# Altium schematic sheet docking_station_with_STLink.SchDoc
size B; SheetNumber: 1; SheetTotal: 1
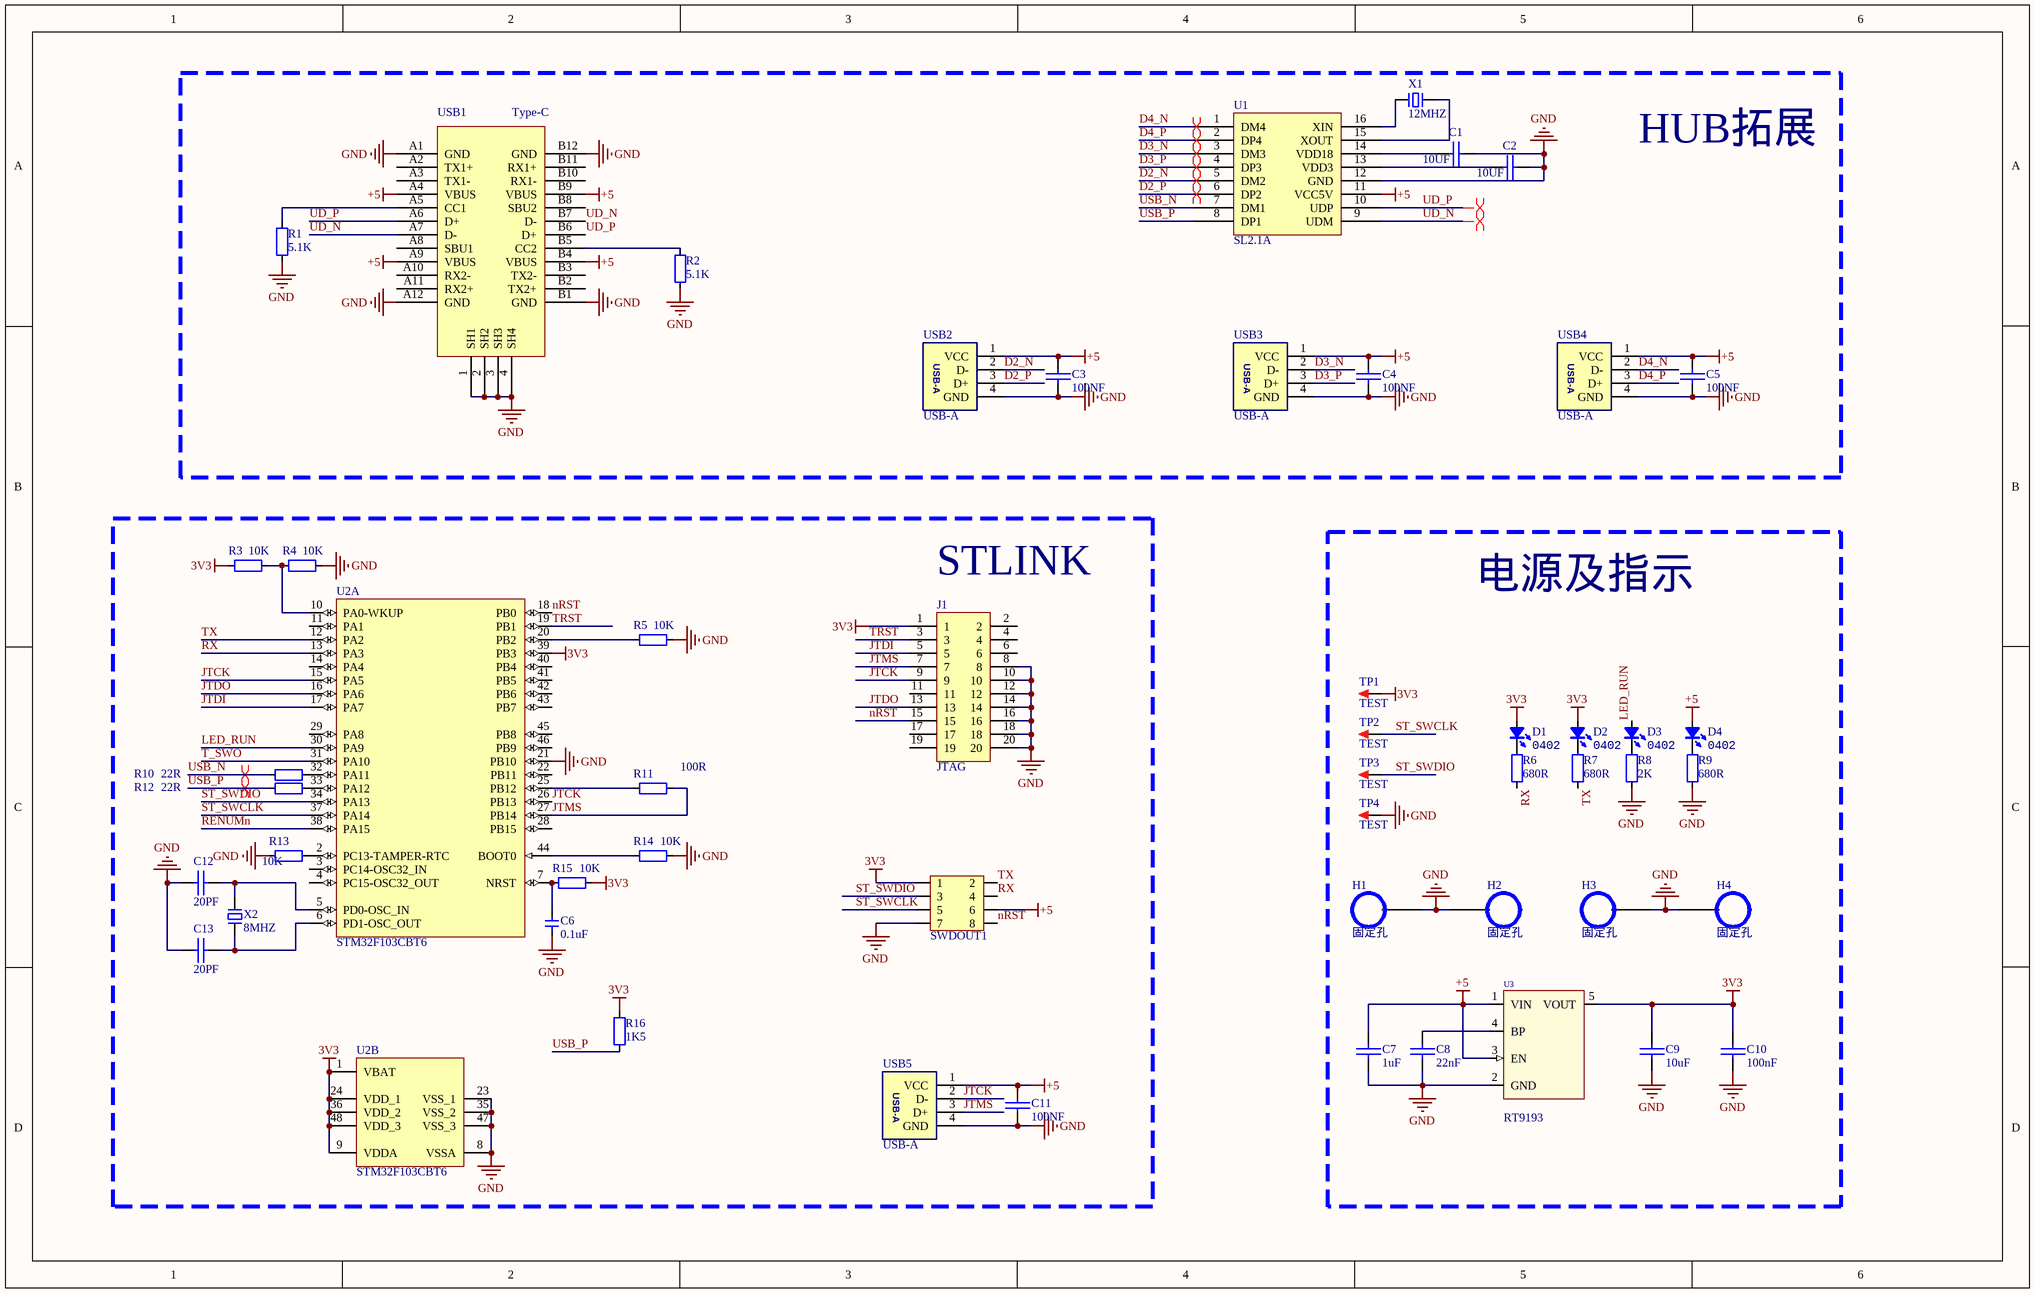
[diagram p0: docking_station_with_STLink.SchDoc]

## Parts
C1  10UF  [0603C]
C2  10UF  [0603C]
C3  100NF  [0603C]
C4  100NF  [0603C]
C5  100NF  [0603C]
C6  0.1uF  [0603C]
C7  1uF  [0603C]
C8  22nF  [0603C]
C9  10uF  [0603C]
C10  100nF  [0603C]
C11  100NF  [0603C]
C12  20PF  [0603C]
C13  20PF  [0603C]
D1  Type: 0402  [LED 0603B]  (hidden comment: color?)
D2  Type: 0402  [LED 0603B]  (hidden comment: color?)
D3  Type: 0402  [LED 0603B]  (hidden comment: color?)
D4  Type: 0402  [LED 0603B]  (hidden comment: color?)
H1  固定孔  [M3x4+6_N]
H2  固定孔  [M3x4+6_N]
H3  固定孔  [M3x4+6_N]
H4  固定孔  [M3x4+6_N]
J1  JTAG  [JLINK]
R1  5.1K  [0603R]
R2  5.1K  [0603R]
R3  10K  [0603R]
R4  10K  [0603R]
R5  10K  [0603R]
R6  680R  [0603R]
R7  680R  [0603R]
R8  2K  [0603R]
R9  680R  [0603R]
R10  22R  [0603R]
R11  100R  [0603R]
R12  22R  [0603R]
R13  10K  [0603R]
R14  10K  [0603R]
R15  10K  [0603R]
R16  1K5  [0603R]
SWDOUT1  HDR2x4_2.54  [Pin HDR2X4/2.54mm-S]  (value not drawn)
TP1  TEST  [TEST 1.6]
TP2  TEST  [TEST 1.6]
TP3  TEST  [TEST 1.6]
TP4  TEST  [TEST 1.6]
U1  SL2.1A  [SOP16]
U2  STM32F103CBT6  [LQFP48 7X7]  (parts A,B of 2)
U3  RT9193  [SOT23-5]
USB1  Type-C  [TYPE-C-SMD_TYPE-C-24P-QCHT]
USB2  USB-A  [USB-A/S_A]
USB3  USB-A  [USB-A/S_A]
USB4  USB-A  [USB-A/S_A]
USB5  USB-A  [USB-A/S_A]
X1  12MHZ  [OSC HC-49S]
X2  8MHZ  [OSC HC-49SMD]

## Blocks framed on the sheet
HUB拓展: C1-C5 R1 R2 U1 USB1-USB4 X1
STLINK: C6 C11-C13 J1 R3-R5 R10-R16 SWDOUT1 U2 USB5 X2
电源及指示: C7-C10 D1-D4 H1-H4 R6-R9 TP1-TP4 U3

## Nets
3V3: C9.2 C10.2 D1.1(A) D2.1(A) J1.1 R3.1 R15.2 R16.2 SWDOUT1.1 TP1.1 U2.1(VBAT) U2.9(VDDA) U2.24(VDD_1) U2.36(VDD_2) U2.39(PB3) U2.48(VDD_3) U3.5(VOUT)
+5: C3.2 C4.2 C5.2 C7.2 C11.2 D4.1(A) SWDOUT1.6 U1.11(VCC5V) U3.1(VIN) U3.3(EN) USB1.A4(VBUS) USB1.A9(VBUS) USB1.B4(VBUS) USB1.B9(VBUS) USB2.1(VCC) USB3.1(VCC) USB4.1(VCC) USB5.1(VCC)
GND: C1.2 C2.2 C3.1 C4.1 C5.1 C6.1 C7.1 C8.1 C9.1 C10.1 C11.1 C12.2 C13.2 H1.1 H2.1 H3.1 H4.1 J1.8 J1.10 J1.12 J1.14 J1.16 J1.18 J1.20 R1.2 R2.2 R4.2 R5.2 R8.1 R9.1 R13.1 R14.2 SWDOUT1.7 TP4.1 U1.12(GND) U2.8(VSSA) U2.21(PB10) U2.23(VSS_1) U2.35(VSS_2) U2.47(VSS_3) U3.2(GND) USB1.1(SH1) USB1.2(SH2) USB1.3(SH3) USB1.4(SH4) USB1.A1(GND) USB1.A12(GND) USB1.B1(GND) USB1.B12(GND) USB2.4(GND) USB3.4(GND) USB4.4(GND) USB5.4(GND)
D2_N: U1.5(DM2) USB2.2(D-)
D2_P: U1.6(DP2) USB2.3(D+)
D3_N: U1.3(DM3) USB3.2(D-)
D3_P: U1.4(DP3) USB3.3(D+)
D4_N: U1.1(DM4) USB4.2(D-)
D4_P: U1.2(DP4) USB4.3(D+)
JTCK: J1.9 U2.15(PA5) U2.26(PB13) USB5.2(D-)
JTDI: J1.5 U2.17(PA7)
JTDO: J1.13 U2.16(PA6)
JTMS: J1.7 R11.2 U2.27(PB14) USB5.3(D+)
LED_RUN: D3.1(A) U2.30(PA9)
nRST: J1.15 SWDOUT1.8 U2.18(PB0)
RENUMn: U2.38(PA15)
RX: R6.1 SWDOUT1.4 U2.13(PA3)
ST_SWCLK: SWDOUT1.5 TP2.1 U2.37(PA14)
ST_SWDIO: SWDOUT1.3 TP3.1 U2.34(PA13)
T_SWO: U2.31(PA10)
TRST: J1.3 U2.19(PB1)
TX: R7.1 SWDOUT1.2 U2.12(PA2)
UD_N: U1.9(UDM) USB1.A7(D-) USB1.B7(D-)
UD_P: U1.10(UDP) USB1.A6(D+) USB1.B6(D+)
USB_N: R10.1 U1.7(DM1)
USB_P: R12.1 R16.1 U1.8(DP1)
NetC1_1: C1.1 U1.14(VDD18)
NetC2_1: C2.1 U1.13(VDD3)
NetC6_2: C6.2 R15.1 U2.7(NRST)
NetC8_2: C8.2 U3.4(BP)
NetC12_1: C12.1 U2.5(PD0-OSC_IN) X2.1
NetC13_1: C13.1 U2.6(PD1-OSC_OUT) X2.2
NetD1_2: D1.2(K) R6.2
NetD2_2: D2.2(K) R7.2
NetD3_2: D3.2(K) R8.2
NetD4_2: D4.2(K) R9.2
NetR1_1: R1.1 USB1.A5(CC1)
NetR2_1: R2.1 USB1.B5(CC2)
NetR3_2: R3.2 R4.1 U2.10(PA0-WKUP)
NetR5_1: R5.1 U2.20(PB2)
NetR10_2: R10.2 U2.32(PA11)
NetR11_1: R11.1 U2.25(PB12)
NetR12_2: R12.2 U2.33(PA12)
NetR13_2: R13.2 U2.2(PC13-TAMPER-RTC)
NetR14_1: R14.1 U2.44(BOOT0)
NetU1_15: U1.15(XOUT) X1.1
NetU1_16: U1.16(XIN) X1.2

Not connected (* = marked no-connect by the designer): J1 2 4 6 11 17 19; U2 3(PC14-OSC32_IN) 4(PC15-OSC32_OUT) 11(PA1) 14(PA4) 22(PB11) 28(PB15) 29(PA8) 40(PB4) 41(PB5) 42(PB6) 43(PB7) 45(PB8) 46(PB9); USB1 A2(TX1+) A3(TX1-) A8(SBU1) A10(RX2-) A11(RX2+) B2(TX2+) B3(TX2-) B8(SBU2) B10(RX1-) B11(RX1+)

## Layout directives
differential pair: D2_N, D2_P, D3_N, D3_P, D4_N, D4_P, UD_N, UD_P, USB_N, USB_P

## Library data of the parts
C1-C5 C7-C13 = CAP: 无极性电容
C6 = 电容-0402: Capacitor; Value: 0.1u
D1-D4 = LED_0402: LED; Value: color?
J1 = Pin HDR2X10
R1-R9 R11 R13-R16 = 电阻-0402: Resistor; Value: 22R
R10 R12 = 电阻-0402: Resistor; Value: 22R
SWDOUT1 = HDR2x4_2.54: Header
TP1-TP4 = TEST: 测试点; 联系卖家，免费查找封装: 唯一出售店铺网址https://shop463601444.taobao.com; BOM名称: 测试点
U1 = SL2.1A: USB2.0扩展
U2 = STM32F103CBT6: ARM Cortex-M3 32-bit MCU, 128 KB Flash, 20 KB Internal RAM, 37 I/Os, 48-pin LQFP, -40 to 85 degC, Tray; A/D Converter: 2x12-bit (10 Channel); FLASH Size (Prog) (kB): 128; I/Os (High Current): 37; Internal RAM Size (kB): 20; Operating Frequency(F) (Processor speed) (MHz): 72; Supply Voltage(Vcc) min (V): 2; DatasheetVersion: Rev. 16; PackageVersion: Rev. 6, 06/2013; PackageReference: LQFP48; PackageDescription: 48-Pin Low Profile Quad Flat Package, 7 x 7 mm Body, 0.5 mm Pitch; Supplier 1: Digi-Key; Supplier Part Number 1: 497-6288-ND; Supplier 2: Farnell; Supplier Part Number 2: 1606327; Core: ARM Cortex-M3; Packing: Tray; Mounting Technology: Surface Mount; PartNumber: STM32F103CBT6; ComponentLink1Description: Manufacturer URL; ComponentLink1URL: http://www.st.com/web/en/home.html; ComponentLink2Description: Datasheet; ComponentLink2URL: http://www.st.com/st-web-ui/static/active/en/resource/technical/document/datasheet/CD00161566.pdf; ComponentLink3Description: Package Specification; ComponentLink3URL: http://www.st.com/st-web-ui/static/active/en/resource/technical/document/datasheet/DM00058181.pdf; Supplier 3: Newark; Supplier Part Number 3: 11N8296; Supplier 4: Newark; Supplier Part Number 4: 57P1214; Supplier 5: Mouser; Supplier Part Number 5: 511-STM32F103CBT6
U3 = RT9193X_5P: ICA_MFR_NAME: RICHTEK; ICA_PARTNUM: $$2191094$$RT9193-15CU5; Part Number: TMP-13
USB1 = USB-Type-C-TOP
X1 X2 = XTAL-2P: 2脚无源脚晶振